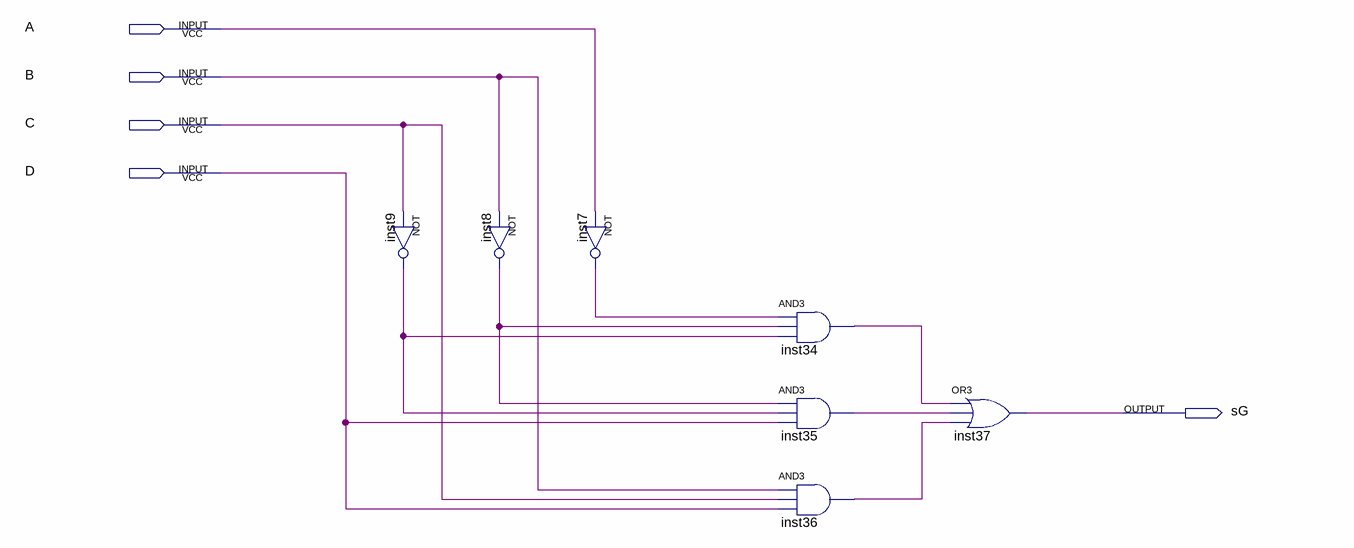
[diagram p0: schematic sheet]
// Quartus schematic decodificadorParcelaSaidaG.bdf as structural Verilog: 7 symbols, 5 pins
module decodificadorParcelaSaidaG (
  input  A,
  input  B,
  input  C,
  input  D,
  output sG
);

  wire inst7_out, inst8_out, inst9_out, inst34_out, inst35_out, inst36_out;

  not inst9 (inst9_out, C);
  not inst8 (inst8_out, B);
  not inst7 (inst7_out, A);
  and inst34 (inst34_out, inst7_out, inst8_out, inst9_out);
  and inst35 (inst35_out, inst8_out, inst9_out, D);
  and inst36 (inst36_out, B, C, D);
  or inst37 (sG, inst34_out, inst35_out, inst36_out);
endmodule
